# Altium schematic sheet RS422_RX.SchDoc
size A; SheetNumber: 2; SheetTotal: 2
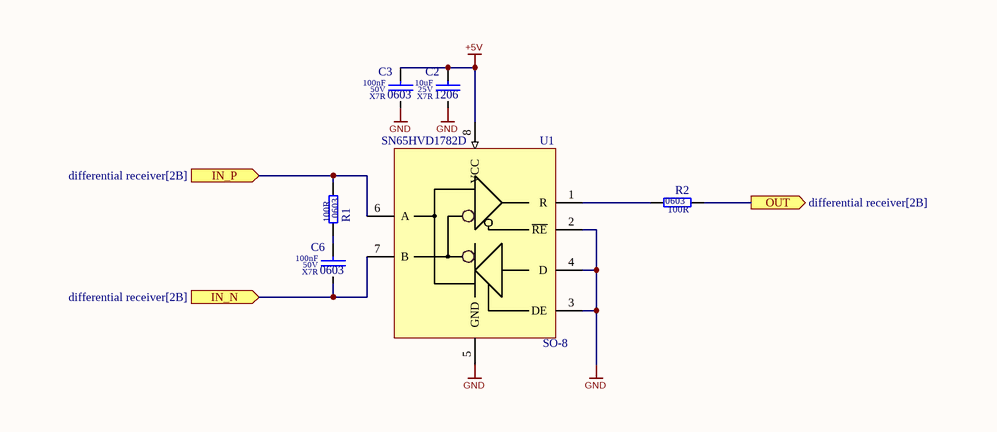
[diagram p0: RS422_RX.SchDoc]

## Parts
C2  value 10uF  Dielectric: X7R  Voltage: 25V  SCH_Footprint: 1206  [C_1206_3216]  (hidden comment: Ceramic X7R)
C3  value 100nF  Dielectric: X7R  Voltage: 50V  SCH_Footprint: 0603  [C_0603_1608]  (hidden comment: Ceramic X7R)
C6  value 100nF  Dielectric: X7R  Voltage: 50V  SCH_Footprint: 0603  [C_0603_1608]  (hidden comment: Ceramic X7R)
R1  value 100R  SCH_Footprint: 0603  [R_0603_1608]  (hidden comment: Resistor)
R2  value 100R  SCH_Footprint: 0603  [R_0603_1608]  (hidden comment: Resistor)
U1  value SN65HVD1782D  SCH_Footprint: SO-8  [SOP8_SO8_SOIC8_4X5X18]  (hidden comment: Transceiver)

## Ports
IN_N (in, see differential receiver[2B]), IN_P (in, see differential receiver[2B]), OUT (out, see differential receiver[2B])

## Nets
+5V: C2.1 C3.1 U1.8(VCC)
GND: C2.2 C3.2 U1.2(~{RE}) U1.3(DE) U1.4(D) U1.5(GND)
IN_N: C6.2 U1.7(B) ; port IN_N
IN_P: R1.2 U1.6(A) ; port IN_P
OUT: R2.1 ; port OUT
NetC6_1: C6.1 R1.1
NetR2_2: R2.2 U1.1(R)

## Library data of the parts
C2 = C_10uF_25V_X7R_1206_10: Capacitor; Manufacturer: Samsung; Manufacturer Part Number: CL31B106KAHNNNE; Tolerance (%): 10; Part Number: C_10uF_25V_X7R_1206_10; HelpURL: http://www.tme.eu/pl/Document/4a42202b32dab16128fe107dd69598cc/samsung-chip-cap.pdf; Supplier 1: TME; Supplier Part Number 1: CL31B106KAHNNNE; Supplier 2: RS Components; Supplier Part Number 2: 766-6773; Supplier 3: Farnell; Supplier Part Number 3: 3013526; Supplier 4: Mouser; Supplier Part Number 4: 187-CL31B106KAHNNNE; Supplier 5: Digi-Key; Supplier Part Number 5: 1276-1804-1-ND; Supplier 6: LCSC
C3 C6 = C_100nF_50V_X7R_0603_5: Capacitor; Manufacturer: Samsung; Manufacturer Part Number: CL10B104JB8NNNC; Tolerance (%): 5; Part Number: C_100nF_50V_X7R_0603_5; HelpURL: http://www.tme.eu/pl/Document/4a42202b32dab16128fe107dd69598cc/samsung-chip-cap.pdf; Supplier 1: TME; Supplier Part Number 1: CL10B104JB8NNNC; Supplier 2: RS Components; Supplier Part Number 2: 7665455; Supplier 3: Farnell; Supplier 4: Mouser; Supplier 5: Digi-Key; Supplier Part Number 5: 1276-1033-1-ND; Supplier 6: LCSC; Supplier Part Number 6: C24452
R1 = R_100R_0603_1_AECQ0: Manufacturer: Panasonic; Manufacturer Part Number: ERJ-3EKF1000V; Voltage: 75V; Power: 100mW; Tolerance: 1%; AEC-Q: 0; Part Number: R_100R_0603_1_AECQ0; HelpURL: https://industrial.panasonic.com/cdbs/www-data/pdf/RDA0000/AOA0000C304.pdf; Supplier 1: TME; Supplier Part Number 1: ERJ3EKF1000V; Supplier 2: RS Components; Supplier 3: Farnell; Supplier Part Number 3: 2303059; Supplier 4: Mouser; Supplier Part Number 4: 667-ERJ-3EKF1000V; Supplier 5: Digi-Key; Supplier Part Number 5: P100HCT-ND; Supplier 6: LCSC; Supplier Part Number 6: C193336
R2 = R_100R_0603_1: Manufacturer: Yageo; Manufacturer Part Number: RC0603FR-07100RL; Voltage: 50V; Power: 100mW; Tolerance: 1%; Part Number: R_100R_0603_1; HelpURL: http://www.tme.eu/en/Document/d2a72e545e5c8eb7bf2a04fa97535928/rc0603yageo.pdf; Supplier 1: TME; Supplier Part Number 1: RC0603FR-07100R; Supplier 2: RS Components; Supplier 3: Farnell; Supplier Part Number 3: 2131804; Supplier 4: Mouser; Supplier Part Number 4: 603-RC0603FR-07100RL; Supplier 5: Digi-Key; Supplier Part Number 5: 311-100HRCT-ND; Supplier 6: LCSC
U1 = U_SN65HVD1782DR: Fault-Protected  RS-485  Transceivers  With 3.3-V to 5-V Operation; Manufacturer: Texas Instruments; Part Number: U_SN65HVD1782DR; HelpURL: http://www.ti.com/lit/ds/slls877h/slls877h.pdf; Manufacturer Part Number: SN65HVD1782D; Supplier 1: TME; Supplier 2: RS Components; Supplier Part Number 2: 7093179P; Supplier 3: Farnell; Supplier Part Number 3: 1755056; Supplier 4: Mouser; Supplier Part Number 4: 595-SN65HVD1782D; Supplier 5: Digi-Key; Supplier Part Number 5: 296-33574-5-ND; Supplier 6: LCSC